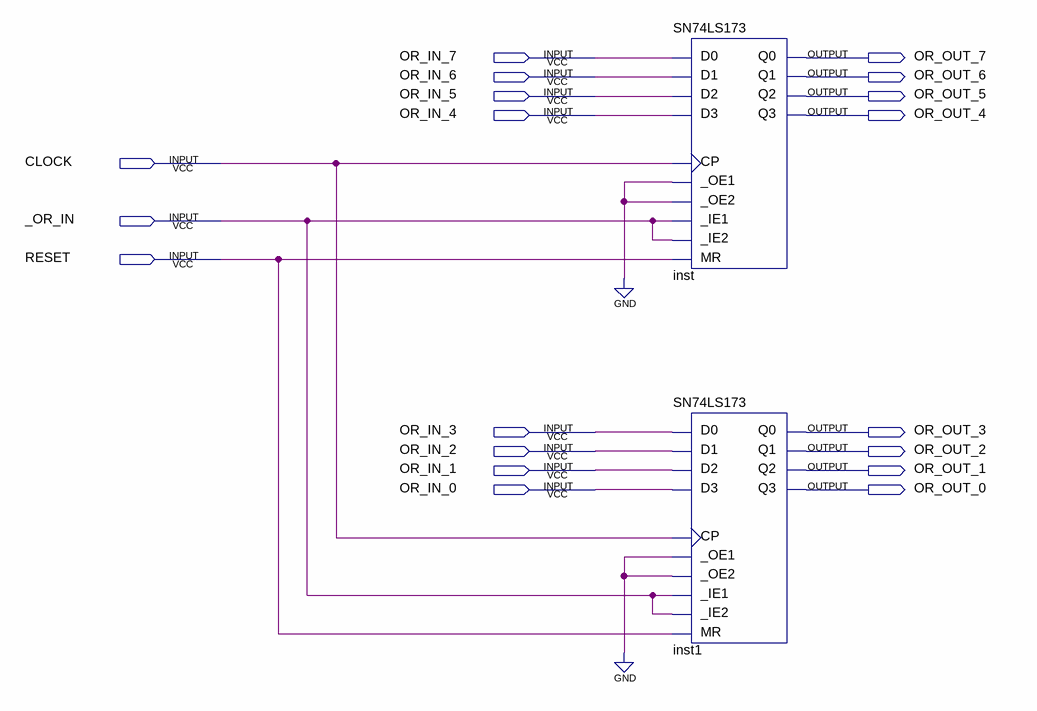
[diagram p0: schematic sheet]
// Quartus schematic OR.bdf as structural Verilog: 2 symbols, 19 pins
module OR (
  input  OR_IN_7,
  input  OR_IN_6,
  input  OR_IN_5,
  input  OR_IN_4,
  input  CLOCK,
  input  _OR_IN,
  input  RESET,
  input  OR_IN_3,
  input  OR_IN_2,
  input  OR_IN_1,
  input  OR_IN_0,
  output OR_OUT_7,
  output OR_OUT_6,
  output OR_OUT_5,
  output OR_OUT_4,
  output OR_OUT_3,
  output OR_OUT_2,
  output OR_OUT_1,
  output OR_OUT_0
);

  SN74LS173 inst (
    .D0(OR_IN_7), .D1(OR_IN_6), .D2(OR_IN_5), .D3(OR_IN_4), ._IE1(_OR_IN), ._IE2(_OR_IN), .CP(CLOCK),
    .MR(RESET), ._OE1(1'b0), ._OE2(1'b0), .Q0(OR_OUT_7), .Q1(OR_OUT_6), .Q2(OR_OUT_5), .Q3(OR_OUT_4));
  SN74LS173 inst1 (
    .D0(OR_IN_3), .D1(OR_IN_2), .D2(OR_IN_1), .D3(OR_IN_0), ._IE1(_OR_IN), ._IE2(_OR_IN), .CP(CLOCK),
    .MR(RESET), ._OE1(1'b0), ._OE2(1'b0), .Q0(OR_OUT_3), .Q1(OR_OUT_2), .Q2(OR_OUT_1), .Q3(OR_OUT_0));
endmodule
